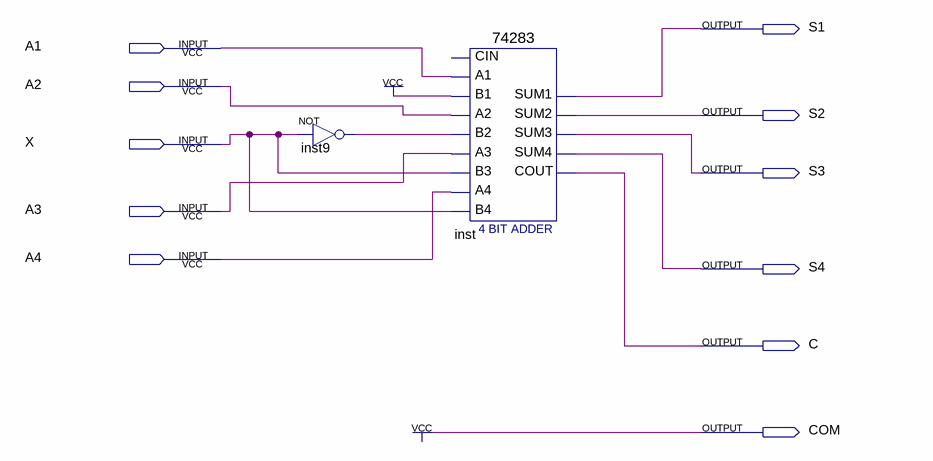
[diagram p0: schematic sheet]
// Quartus schematic change.bdf as structural Verilog: 2 symbols, 11 pins
module change (
  input  A1,
  input  A2,
  input  X,
  input  A3,
  input  A4,
  output S1,
  output S2,
  output S3,
  output S4,
  output C,
  output COM
);

  wire inst9_out;

  not inst9 (inst9_out, X);
  \74283  inst (
    .A1(A1), .A2(A2), .B2(inst9_out), .A3(A3), .A4(A4), .B4(X), .B1(1'b1), .B3(X), .SUM4(S4), .COUT(C),
    .SUM1(S1), .SUM2(S2), .SUM3(S3));  // open: CIN

  assign COM = 1'b1;
endmodule
